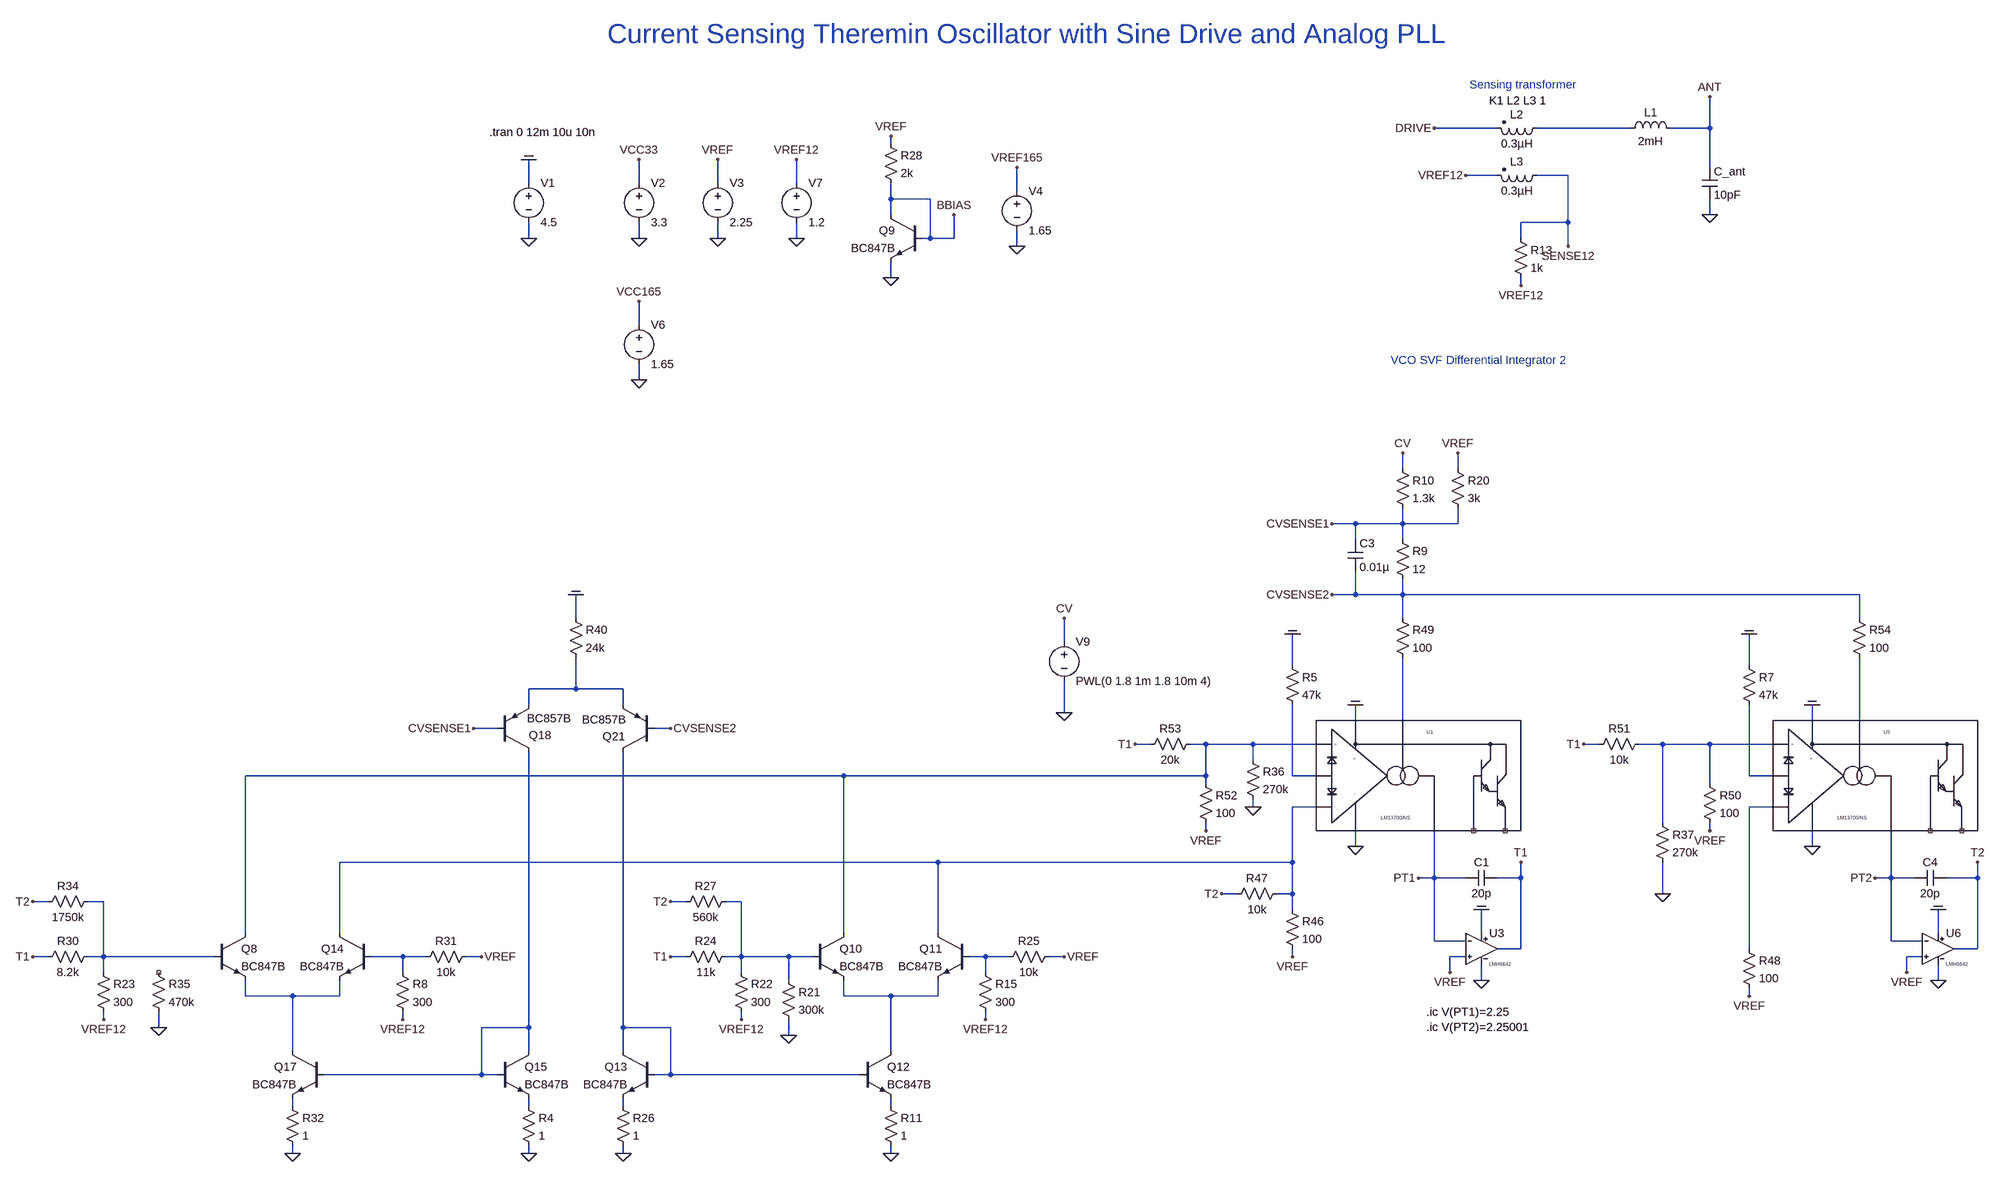
[diagram p0: schematic theremin_oscillator_ota_v04.asc]
theremin_oscillator_ota_v04.asc, the LTspice schematic file:
Version 4
SHEET 1 17540 12720
WIRE 5840 3776 5712 3776
WIRE 6112 3776 5920 3776
WIRE 6272 3776 6272 3712
WIRE 6272 3776 6192 3776
WIRE 4608 3808 4608 3792
WIRE 6272 3856 6272 3776
WIRE 5840 3872 5776 3872
WIRE 5984 3872 5920 3872
WIRE 3872 3888 3872 3840
WIRE 4096 3888 4096 3840
WIRE 4256 3888 4256 3840
WIRE 4416 3888 4416 3840
WIRE 4864 3904 4864 3856
WIRE 4608 3920 4608 3888
WIRE 4688 3920 4608 3920
WIRE 4608 3952 4608 3920
WIRE 6272 3952 6272 3920
WIRE 5984 3968 5984 3872
WIRE 5984 3968 5888 3968
WIRE 3872 4000 3872 3968
WIRE 4096 4000 4096 3968
WIRE 4256 4000 4256 3968
WIRE 4416 4000 4416 3968
WIRE 4688 4000 4688 3920
WIRE 4688 4000 4672 4000
WIRE 4736 4000 4736 3952
WIRE 4736 4000 4688 4000
WIRE 5888 4000 5888 3968
WIRE 4864 4016 4864 3984
WIRE 5984 4016 5984 3968
WIRE 4608 4080 4608 4048
WIRE 5888 4096 5888 4080
WIRE 4096 4176 4096 4128
WIRE 4096 4288 4096 4256
WIRE 5648 4560 5648 4528
WIRE 5760 4560 5760 4528
WIRE 5552 4672 5504 4672
WIRE 5648 4672 5648 4640
WIRE 5648 4672 5552 4672
WIRE 5760 4672 5760 4640
WIRE 5760 4672 5648 4672
WIRE 5552 4704 5552 4672
WIRE 5648 4704 5648 4672
WIRE 5552 4816 5552 4768
WIRE 5552 4816 5504 4816
WIRE 5648 4816 5648 4784
WIRE 5648 4816 5552 4816
WIRE 6576 4816 5648 4816
WIRE 3968 4864 3968 4816
WIRE 5648 4864 5648 4816
WIRE 6576 4864 6576 4816
WIRE 4960 4912 4960 4864
WIRE 5424 4960 5424 4896
WIRE 6352 4960 6352 4896
WIRE 3968 5008 3968 4944
WIRE 3968 5008 3872 5008
WIRE 4064 5008 3968 5008
WIRE 3872 5040 3872 5008
WIRE 4064 5040 4064 5008
WIRE 4960 5056 4960 4992
WIRE 5552 5072 5552 5040
WIRE 5648 5072 5648 4944
WIRE 6480 5072 6480 5040
WIRE 6576 5072 6576 4944
WIRE 3808 5088 3760 5088
WIRE 4160 5088 4128 5088
WIRE 5136 5120 5104 5120
WIRE 5248 5120 5216 5120
WIRE 5344 5120 5248 5120
WIRE 5472 5120 5344 5120
WIRE 6048 5120 6016 5120
WIRE 6176 5120 6128 5120
WIRE 6272 5120 6176 5120
WIRE 6400 5120 6272 5120
WIRE 5344 5152 5344 5120
WIRE 4512 5184 3296 5184
WIRE 5248 5184 5248 5120
WIRE 5248 5184 4512 5184
WIRE 5424 5184 5424 5040
WIRE 5472 5184 5424 5184
WIRE 6352 5184 6352 5040
WIRE 6400 5184 6352 5184
WIRE 5248 5200 5248 5184
WIRE 6272 5200 6272 5120
WIRE 5344 5248 5344 5232
WIRE 5472 5248 5424 5248
WIRE 6400 5248 6352 5248
WIRE 6176 5280 6176 5120
WIRE 5248 5296 5248 5280
WIRE 6272 5296 6272 5280
WIRE 5552 5328 5552 5296
WIRE 6480 5328 6480 5296
WIRE 4704 5360 3488 5360
WIRE 5424 5360 5424 5248
WIRE 5424 5360 4704 5360
WIRE 5712 5392 5712 5296
WIRE 5712 5392 5680 5392
WIRE 5776 5392 5712 5392
WIRE 5888 5392 5888 5360
WIRE 5888 5392 5840 5392
WIRE 6640 5392 6640 5296
WIRE 6640 5392 6608 5392
WIRE 6688 5392 6640 5392
WIRE 6816 5392 6816 5360
WIRE 6816 5392 6752 5392
WIRE 5312 5424 5280 5424
WIRE 5424 5424 5424 5360
WIRE 5424 5424 5392 5424
WIRE 6176 5424 6176 5360
WIRE 2896 5440 2864 5440
WIRE 3008 5440 2976 5440
WIRE 4192 5440 4160 5440
WIRE 4304 5440 4272 5440
WIRE 5424 5456 5424 5424
WIRE 3296 5504 3296 5184
WIRE 3488 5504 3488 5360
WIRE 4512 5504 4512 5184
WIRE 4704 5504 4704 5360
WIRE 5808 5504 5808 5456
WIRE 6736 5504 6736 5456
WIRE 5712 5520 5712 5392
WIRE 5776 5520 5712 5520
WIRE 6640 5520 6640 5392
WIRE 6704 5520 6640 5520
WIRE 5888 5536 5888 5392
WIRE 5888 5536 5840 5536
WIRE 6352 5536 6352 5248
WIRE 6816 5536 6816 5392
WIRE 6816 5536 6768 5536
WIRE 2896 5552 2864 5552
WIRE 3008 5552 3008 5440
WIRE 3008 5552 2976 5552
WIRE 3232 5552 3008 5552
WIRE 3616 5552 3552 5552
WIRE 3664 5552 3616 5552
WIRE 3776 5552 3744 5552
WIRE 4192 5552 4160 5552
WIRE 4304 5552 4304 5440
WIRE 4304 5552 4272 5552
WIRE 4400 5552 4304 5552
WIRE 4448 5552 4400 5552
WIRE 4800 5552 4768 5552
WIRE 4848 5552 4800 5552
WIRE 4960 5552 4928 5552
WIRE 5424 5552 5424 5536
WIRE 5776 5552 5744 5552
WIRE 6704 5552 6672 5552
WIRE 3008 5584 3008 5552
WIRE 3616 5584 3616 5552
WIRE 4304 5584 4304 5552
WIRE 4800 5584 4800 5552
WIRE 5744 5584 5744 5552
WIRE 6672 5584 6672 5552
WIRE 4400 5600 4400 5552
WIRE 5808 5600 5808 5568
WIRE 6736 5600 6736 5568
WIRE 3296 5632 3296 5600
WIRE 3392 5632 3296 5632
WIRE 3488 5632 3488 5600
WIRE 3488 5632 3392 5632
WIRE 4512 5632 4512 5600
WIRE 4608 5632 4512 5632
WIRE 4704 5632 4704 5600
WIRE 4704 5632 4608 5632
WIRE 6352 5632 6352 5616
WIRE 3008 5680 3008 5664
WIRE 3616 5680 3616 5664
WIRE 4304 5680 4304 5664
WIRE 4800 5680 4800 5664
WIRE 3120 5696 3120 5664
WIRE 3872 5696 3872 5136
WIRE 3872 5696 3776 5696
WIRE 4064 5696 4064 5136
WIRE 4160 5696 4064 5696
WIRE 4400 5712 4400 5680
WIRE 3392 5744 3392 5632
WIRE 3872 5744 3872 5696
WIRE 4064 5744 4064 5696
WIRE 4608 5744 4608 5632
WIRE 3776 5792 3776 5696
WIRE 3776 5792 3456 5792
WIRE 3808 5792 3776 5792
WIRE 4160 5792 4160 5696
WIRE 4160 5792 4128 5792
WIRE 4544 5792 4160 5792
WIRE 3392 5856 3392 5840
WIRE 3872 5856 3872 5840
WIRE 4064 5856 4064 5840
WIRE 4608 5856 4608 5840
WIRE 3392 5952 3392 5936
WIRE 3872 5952 3872 5936
WIRE 4064 5952 4064 5936
WIRE 4608 5952 4608 5936
FLAG 3872 4000 0
FLAG 3872 3840 COM
FLAG 4096 4000 0
FLAG 4096 3840 VCC33
FLAG 4256 4000 0
FLAG 4256 3840 VREF
FLAG 6272 3712 ANT
FLAG 6272 3952 0
FLAG 5712 3776 DRIVE
FLAG 4416 4000 0
FLAG 4416 3840 VREF12
FLAG 5776 3872 VREF12
FLAG 5984 4016 SENSE12
FLAG 5888 4096 VREF12
FLAG 4608 4080 0
FLAG 4736 3952 BBIAS
FLAG 4608 3792 VREF
FLAG 4864 4016 0
FLAG 4864 3856 VREF165
FLAG 4096 4288 0
FLAG 4096 4128 VCC165
FLAG 5552 5328 0
FLAG 5552 5040 COM
FLAG 5808 5600 0
FLAG 5808 5456 COM
FLAG 5744 5584 VREF
FLAG 5888 5360 T1
FLAG 5680 5392 PT1
FLAG 6480 5328 0
FLAG 6480 5040 COM
FLAG 6736 5600 0
FLAG 6736 5456 COM
FLAG 6672 5584 VREF
FLAG 6816 5360 T2
FLAG 6608 5392 PT2
FLAG 5424 5552 VREF
FLAG 5280 5424 T2
FLAG 6352 5632 VREF
FLAG 6272 5296 VREF
FLAG 6016 5120 T1
FLAG 5248 5296 VREF
FLAG 5104 5120 T1
FLAG 5424 4896 COM
FLAG 6352 4896 COM
FLAG 4608 5952 0
FLAG 4800 5680 VREF12
FLAG 4064 5952 0
FLAG 4960 5552 VREF
FLAG 4960 5056 0
FLAG 4960 4864 CV
FLAG 5648 4528 CV
FLAG 5760 4528 VREF
FLAG 5504 4672 CVSENSE1
FLAG 5504 4816 CVSENSE2
FLAG 4400 5712 0
FLAG 3872 5952 0
FLAG 3616 5680 VREF12
FLAG 3008 5680 VREF12
FLAG 2864 5552 T1
FLAG 3392 5952 0
FLAG 3776 5552 VREF
FLAG 2864 5440 T2
FLAG 3120 5696 0
FLAG 3760 5088 CVSENSE1
FLAG 4160 5088 CVSENSE2
FLAG 4304 5680 VREF12
FLAG 4160 5552 T1
FLAG 4160 5440 T2
FLAG 5344 5248 0
FLAG 6176 5424 0
FLAG 3968 4816 COM
SYMBOL voltage 3872 3872 R0
SYMATTR InstName V1
SYMATTR Value 4.5
SYMBOL voltage 4096 3872 R0
SYMATTR InstName V2
SYMATTR Value 3.3
SYMBOL voltage 4256 3872 R0
SYMATTR InstName V3
SYMATTR Value 2.25
SYMBOL ind 6096 3792 R270
WINDOW 0 32 56 VTop 2
WINDOW 3 5 56 VBottom 2
SYMATTR InstName L1
SYMATTR Value 2mH
SYMATTR SpiceLine Rser=120 Cpar=1pF
SYMBOL Cap 6256 3856 R0
SYMATTR InstName C_ant
SYMATTR Value 10pF
SYMBOL voltage 4416 3872 R0
SYMATTR InstName V7
SYMATTR Value 1.2
SYMBOL ind2 5936 3760 R90
WINDOW 0 4 56 VBottom 2
WINDOW 3 32 56 VTop 2
SYMATTR InstName L2
SYMATTR Value 0.3µH
SYMATTR SpiceLine Rser=0.1 Cpar=0.1p
SYMBOL ind2 5936 3856 R90
WINDOW 0 4 56 VBottom 2
WINDOW 3 32 56 VTop 2
SYMATTR InstName L3
SYMATTR Value 0.3µH
SYMATTR SpiceLine Rser=0.1 Cpar=0.1p
SYMBOL Res 5872 3984 R0
SYMATTR InstName R13
SYMATTR Value 1k
SYMBOL npn 4672 3952 M0
SYMATTR InstName Q9
SYMATTR Value BC847B
SYMBOL Res 4592 3792 R0
SYMATTR InstName R28
SYMATTR Value 2k
SYMBOL voltage 4864 3888 R0
SYMATTR InstName V4
SYMATTR Value 1.65
SYMBOL voltage 4096 4160 R0
SYMATTR InstName V6
SYMATTR Value 1.65
SYMBOL LM13700 5552 5184 R0
SYMATTR InstName U1
SYMBOL Cap 5840 5376 R90
WINDOW 0 0 32 VBottom 2
WINDOW 3 32 32 VTop 2
SYMATTR InstName C1
SYMATTR Value 20p
SYMBOL LMH6642 5808 5472 R0
WINDOW 0 16 32 Left 2
SYMATTR InstName U3
SYMBOL LM13700 6480 5184 R0
SYMATTR InstName U5
SYMBOL Cap 6752 5376 R90
WINDOW 0 0 32 VBottom 2
WINDOW 3 32 32 VTop 2
SYMATTR InstName C4
SYMATTR Value 20p
SYMBOL LMH6642 6736 5472 R0
WINDOW 0 16 32 Left 2
SYMATTR InstName U6
SYMBOL Res 5408 5440 R0
SYMATTR InstName R46
SYMATTR Value 100
SYMBOL Res 5408 5408 R90
WINDOW 0 0 56 VBottom 2
WINDOW 3 32 56 VTop 2
SYMATTR InstName R47
SYMATTR Value 10k
SYMBOL Res 6336 5520 R0
SYMATTR InstName R48
SYMATTR Value 100
SYMBOL Res 6256 5184 R0
SYMATTR InstName R50
SYMATTR Value 100
SYMBOL Res 6144 5104 R90
WINDOW 0 0 56 VBottom 2
WINDOW 3 32 56 VTop 2
SYMATTR InstName R51
SYMATTR Value 10k
SYMBOL Res 5232 5184 R0
SYMATTR InstName R52
SYMATTR Value 100
SYMBOL Res 5232 5104 R90
WINDOW 0 0 56 VBottom 2
WINDOW 3 32 56 VTop 2
SYMATTR InstName R53
SYMATTR Value 20k
SYMBOL Res 5632 4848 R0
SYMATTR InstName R49
SYMATTR Value 100
SYMBOL Res 6560 4848 R0
SYMATTR InstName R54
SYMATTR Value 100
SYMBOL Res 5408 4944 R0
SYMATTR InstName R5
SYMATTR Value 47k
SYMBOL Res 6336 4944 R0
SYMATTR InstName R7
SYMATTR Value 47k
SYMBOL npn 4448 5504 R0
SYMATTR InstName Q10
SYMATTR Value BC847B
SYMBOL npn 4768 5504 M0
SYMATTR InstName Q11
SYMATTR Value BC847B
SYMBOL Res 4592 5840 R0
SYMATTR InstName R11
SYMATTR Value 1
SYMBOL npn 4544 5744 R0
SYMATTR InstName Q12
SYMATTR Value BC847B
SYMBOL Res 4784 5568 R0
SYMATTR InstName R15
SYMATTR Value 300
SYMBOL Res 4944 5536 R90
WINDOW 0 0 56 VBottom 2
WINDOW 3 32 56 VTop 2
SYMATTR InstName R25
SYMATTR Value 10k
SYMBOL Res 4048 5840 R0
SYMATTR InstName R26
SYMATTR Value 1
SYMBOL npn 4128 5744 M0
SYMATTR InstName Q13
SYMATTR Value BC847B
SYMBOL Res 5632 4688 R0
SYMATTR InstName R9
SYMATTR Value 12
SYMBOL Voltage 4960 4896 R0
SYMATTR InstName V9
SYMATTR Value PWL(0 1.8 1m 1.8 10m 4)
SYMBOL Res 5632 4544 R0
SYMATTR InstName R10
SYMATTR Value 1.3k
SYMBOL Res 5744 4544 R0
SYMATTR InstName R20
SYMATTR Value 3k
SYMBOL Res 4384 5584 R0
SYMATTR InstName R21
SYMATTR Value 300k
SYMBOL npn 3232 5504 R0
SYMATTR InstName Q8
SYMATTR Value BC847B
SYMBOL npn 3552 5504 M0
SYMATTR InstName Q14
SYMATTR Value BC847B
SYMBOL Res 3856 5840 R0
SYMATTR InstName R4
SYMATTR Value 1
SYMBOL npn 3808 5744 R0
SYMATTR InstName Q15
SYMATTR Value BC847B
SYMBOL Res 3600 5568 R0
SYMATTR InstName R8
SYMATTR Value 300
SYMBOL Res 2992 5568 R0
SYMATTR InstName R23
SYMATTR Value 300
SYMBOL Res 2992 5536 R90
WINDOW 0 0 56 VBottom 2
WINDOW 3 32 56 VTop 2
SYMATTR InstName R30
SYMATTR Value 8.2k
SYMBOL Res 3760 5536 R90
WINDOW 0 0 56 VBottom 2
WINDOW 3 32 56 VTop 2
SYMATTR InstName R31
SYMATTR Value 10k
SYMBOL Res 3376 5840 R0
SYMATTR InstName R32
SYMATTR Value 1
SYMBOL npn 3456 5744 M0
SYMATTR InstName Q17
SYMATTR Value BC847B
SYMBOL Res 2992 5424 R90
WINDOW 0 0 56 VBottom 2
WINDOW 3 32 56 VTop 2
SYMATTR InstName R34
SYMATTR Value 1750k
SYMBOL Res 3104 5568 R0
SYMATTR InstName R35
SYMATTR Value 470k
SYMBOL pnp 3808 5136 M180
WINDOW 0 64 34 Left 2
WINDOW 3 61 68 Left 2
SYMATTR InstName Q18
SYMATTR Value BC857B
SYMBOL pnp 4128 5136 R180
WINDOW 0 60 32 Left 2
WINDOW 3 58 66 Left 2
SYMATTR InstName Q21
SYMATTR Value BC857B
SYMBOL Res 4288 5568 R0
SYMATTR InstName R22
SYMATTR Value 300
SYMBOL Res 4288 5536 R90
WINDOW 0 0 56 VBottom 2
WINDOW 3 32 56 VTop 2
SYMATTR InstName R24
SYMATTR Value 11k
SYMBOL Res 4288 5424 R90
WINDOW 0 0 56 VBottom 2
WINDOW 3 32 56 VTop 2
SYMATTR InstName R27
SYMATTR Value 560k
SYMBOL Res 5328 5136 R0
SYMATTR InstName R36
SYMATTR Value 270k
SYMBOL Res 6160 5264 R0
SYMATTR InstName R37
SYMATTR Value 270k
SYMBOL Res 3952 4848 R0
SYMATTR InstName R40
SYMATTR Value 24k
SYMBOL Cap 5536 4704 R0
SYMATTR InstName C3
SYMATTR Value 0.01µ
TEXT 3792 3784 Left 2 !.tran 0 12m 10u 10n
TEXT 4032 3584 Left 5 ;Current Sensing Theremin Oscillator with Sine Drive and Analog PLL
TEXT 5824 3720 Left 2 !K1 L2 L3 1
TEXT 5784 3688 Left 2 ;Sensing transformer
TEXT 5624 4248 Left 2 ;VCO SVF Differential Integrator 2
TEXT 5696 5664 Left 2 !.ic V(PT1)=2.25\n.ic V(PT2)=2.25001

The netlist it stands for:
* theremin_oscillator_ota_v04.asc
V1 COM 0 4.5
V2 VCC33 0 3.3
V3 VREF 0 2.25
L1 N001 ANT 2mH Rser=120 Cpar=1pF
C_ant ANT 0 10pF
V7 VREF12 0 1.2
L2 N001 DRIVE 0.3µH Rser=0.1 Cpar=0.1p
L3 SENSE12 VREF12 0.3µH Rser=0.1 Cpar=0.1p
R13 SENSE12 VREF12 1k
Q9 BBIAS BBIAS 0 0 BC847B
R28 VREF BBIAS 2k
V4 VREF165 0 1.65
V6 VCC165 0 1.65
XU1 N003 N007 N005 N009 PT1 0 NC_01 NC_02 COM LM13700/NS  ; pins Ibias Dio_bias in+ in- out V- buf_in buf_out V+
C1 T1 PT1 20p
XU3 PT1 VREF COM 0 T1 LMH6642  ; pins In- In+ V+ V- OUT
XU5 N004 N008 N006 N010 PT2 0 NC_03 NC_04 COM LM13700/NS  ; pins Ibias Dio_bias in+ in- out V- buf_in buf_out V+
C4 T2 PT2 20p
XU6 PT2 VREF COM 0 T2 LMH6642  ; pins In- In+ V+ V- OUT
R46 N009 VREF 100
R47 N009 T2 10k
R48 N010 VREF 100
R50 N006 VREF 100
R51 N006 T1 10k
R52 N005 VREF 100
R53 N005 T1 20k
R49 CVSENSE2 N003 100
R54 CVSENSE2 N004 100
R5 COM N007 47k
R7 COM N008 47k
Q10 N005 N012 N016 0 BC847B
Q11 N009 N014 N016 0 BC847B
R11 N022 0 1
Q12 N016 N018 N022 0 BC847B
R15 N014 VREF12 300
R25 VREF N014 10k
R26 N021 0 1
Q13 N018 N018 N021 0 BC847B
R9 CVSENSE1 CVSENSE2 12
V9 CV 0 PWL(0 1.8 1m 1.8 10m 4)
R10 CV CVSENSE1 1.3k
R20 VREF CVSENSE1 3k
R21 N012 0 300k
Q8 N005 N011 N015 0 BC847B
Q14 N009 N013 N015 0 BC847B
R4 N020 0 1
Q15 N017 N017 N020 0 BC847B
R8 N013 VREF12 300
R23 N011 VREF12 300
R30 N011 T1 8.2k
R31 VREF N013 10k
R32 N019 0 1
Q17 N015 N017 N019 0 BC847B
R34 N011 T2 1750k
R35 NC_05 0 470k
Q18 N017 CVSENSE1 N002 0 BC857B
Q21 N018 CVSENSE2 N002 0 BC857B
R22 N012 VREF12 300
R24 N012 T1 11k
R27 N012 T2 560k
R36 N005 0 270k
R37 N006 0 270k
R40 COM N002 24k
C3 CVSENSE1 CVSENSE2 0.01µ
.model NPN NPN
.model PNP PNP
.lib standard.bjt
.tran 0 12m 10u 10n
* Current Sensing Theremin Oscillator with Sine Drive and Analog PLL
K1 L2 L3 1
* Sensing transformer
* VCO SVF Differential Integrator 2
.ic V(PT1)=2.25
.ic V(PT2)=2.25001
.lib ns_models.lib
.lib LMH6642.MOD
.backanno
.end